# Altium schematic sheet IB_V2_MOSFET.SchDoc
size A3; SheetNumber: 3; SheetTotal: 5
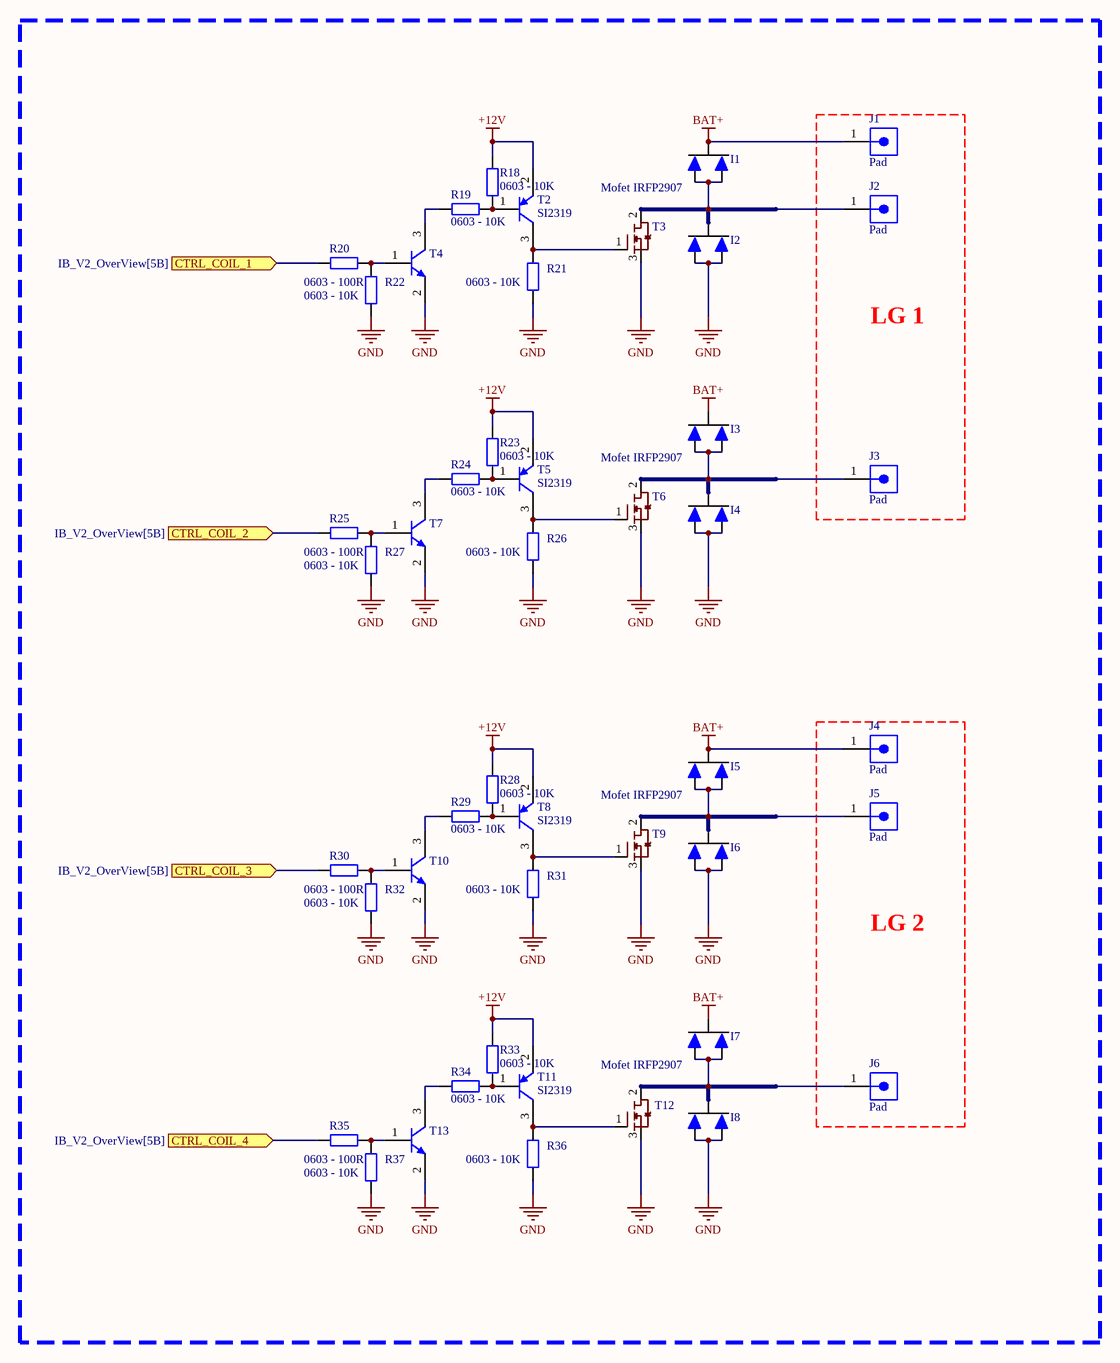
[diagram p0: IB_V2_MOSFET.SchDoc]

## Parts
I1  12CWQ10FN  [TO-252]  (value not drawn)
I2  12CWQ10FN  [TO-252]  (value not drawn)
I3  12CWQ10FN  [TO-252]  (value not drawn)
I4  12CWQ10FN  [TO-252]  (value not drawn)
I5  12CWQ10FN  [TO-252]  (value not drawn)
I6  12CWQ10FN  [TO-252]  (value not drawn)
I7  12CWQ10FN  [TO-252]  (value not drawn)
I8  12CWQ10FN  [TO-252]  (value not drawn)
J1  Pad  [pad_4.5x4.5_hole_2.5mm]
J2  Pad  [pad_4.5x4.5_hole_2.5mm]
J3  Pad  [pad_4.5x4.5_hole_2.5mm]
J4  Pad  [pad_4.5x4.5_hole_2.5mm]
J5  Pad  [pad_4.5x4.5_hole_2.5mm]
J6  Pad  [pad_4.5x4.5_hole_2.5mm]
R18  0603 - 10K  [tro smd 0603]
R19  0603 - 10K  [tro smd 0603]
R20  0603 - 100R  [tro smd 0603]
R21  0603 - 10K  [tro smd 0603]
R22  0603 - 10K  [tro smd 0603]
R23  0603 - 10K  [tro smd 0603]
R24  0603 - 10K  [tro smd 0603]
R25  0603 - 100R  [tro smd 0603]
R26  0603 - 10K  [tro smd 0603]
R27  0603 - 10K  [tro smd 0603]
R28  0603 - 10K  [tro smd 0603]
R29  0603 - 10K  [tro smd 0603]
R30  0603 - 100R  [tro smd 0603]
R31  0603 - 10K  [tro smd 0603]
R32  0603 - 10K  [tro smd 0603]
R33  0603 - 10K  [tro smd 0603]
R34  0603 - 10K  [tro smd 0603]
R35  0603 - 100R  [tro smd 0603]
R36  0603 - 10K  [tro smd 0603]
R37  0603 - 10K  [tro smd 0603]
T2  SI2319  [SOT - 23]
T3  Mofet IRFP2907  [TO 247 AC]
T4  MMBT2222A 1P Transistor NPN  [SOT - 23]  (value not drawn)
T5  SI2319  [SOT - 23]
T6  Mofet IRFP2907  [TO 247 AC]
T7  MMBT2222A 1P Transistor NPN  [SOT - 23]  (value not drawn)
T8  SI2319  [SOT - 23]
T9  Mofet IRFP2907  [TO 247 AC]
T10  MMBT2222A 1P Transistor NPN  [SOT - 23]  (value not drawn)
T11  SI2319  [SOT - 23]
T12  Mofet IRFP2907  [TO 247 AC]
T13  MMBT2222A 1P Transistor NPN  [SOT - 23]  (value not drawn)

## Blocks framed on the sheet
LG 1: J1-J3
LG 2: J4-J6

## Ports
CTRL_COIL_1 (in, see IB_V2_OverView[5B]), CTRL_COIL_2 (in, see IB_V2_OverView[5B]), CTRL_COIL_3 (in, see IB_V2_OverView[5B]), CTRL_COIL_4 (in, see IB_V2_OverView[5B])

## Nets
+12V: R18.1 R23.1 R28.1 R33.1 T2.2(E) T5.2(E) T8.2(E) T11.2(E)
BAT+: I1.2(Ktot) I3.2(Ktot) I5.2(Ktot) I7.2(Ktot) J1.1 J4.1
GND: I2.1(Anot) I2.3(Anot) I4.1(Anot) I4.3(Anot) I6.1(Anot) I6.3(Anot) I8.1(Anot) I8.3(Anot) R21.1 R22.1 R26.1 R27.1 R31.1 R32.1 R36.1 R37.1 T3.3(S) T4.2(E) T6.3(S) T7.2(E) T9.3(S) T10.2(E) T12.3(S) T13.2(E)
CTRL_COIL_1: R20.2 ; port CTRL_COIL_1
CTRL_COIL_2: R25.2 ; port CTRL_COIL_2
CTRL_COIL_3: R30.2 ; port CTRL_COIL_3
CTRL_COIL_4: R35.2 ; port CTRL_COIL_4
NetI1_1: I1.1(Anot) I1.3(Anot) I2.2(Ktot) J2.1 T3.2(D)
NetI3_1: I3.1(Anot) I3.3(Anot) I4.2(Ktot) J3.1 T6.2(D)
NetI5_1: I5.1(Anot) I5.3(Anot) I6.2(Ktot) J5.1 T9.2(D)
NetI7_1: I7.1(Anot) I7.3(Anot) I8.2(Ktot) J6.1 T12.2(D)
NetR18_2: R18.2 R19.1 T2.1(B)
NetR19_2: R19.2 T4.3(C)
NetR20_1: R20.1 R22.2 T4.1(B)
NetR21_2: R21.2 T2.3(C) T3.1(G)
NetR23_2: R23.2 R24.1 T5.1(B)
NetR24_2: R24.2 T7.3(C)
NetR25_1: R25.1 R27.2 T7.1(B)
NetR26_2: R26.2 T5.3(C) T6.1(G)
NetR28_2: R28.2 R29.1 T8.1(B)
NetR29_2: R29.2 T10.3(C)
NetR30_1: R30.1 R32.2 T10.1(B)
NetR31_2: R31.2 T8.3(C) T9.1(G)
NetR33_2: R33.2 R34.1 T11.1(B)
NetR34_2: R34.2 T13.3(C)
NetR35_1: R35.1 R37.2 T13.1(B)
NetR36_2: R36.2 T11.3(C) T12.1(G)

## Library data of the parts
I1-I8 = Diode - 12CWQ10FN: Diode Schottky 100V 12A, SMD DPAK
J1-J6 = Pad: Ports: 1; Positions/Loaded: Port1 - 4/2; PerformanceCategory: 3; PCB_Mounting: Thru-Hole; PCB_Thickness: 0.125"; DrillSize: Nominal, Rounded to nearest 0.05mm; PCB_Layout: Complies with Manufacturer's Recommendation.; Published: 25-Jun-2002; DatasheetDocument: 20-Nov-2001; PackageDocument: 20-Nov-2001; PackageReference: 42878-4410; Publisher: Altium Limited; ComponentLink1Description: Manufacturer Link; ComponentLink1URL: http://www.molex.com/; ComponentLink2Description: Datasheet; ComponentLink2URL: http://www.molex.com/cmc_upload/common_files/1212003_42878catalogpage.pdf
R18-R37 = Tro 0603 1% 680R: Dán; Don_Vi: Con; So_Chan: 2; Ten_Linh_Kien: Trở 0603 1% 680R; Ma_Hang: MH006336; Chung_Loai: Dán; Kieu_Chan: *
T2 T5 T8 T11 = Transistor - A1015: P-Channel 40-V(D-S) MOSEFET / SOT-23/3 LEAD
T3 T6 T9 T12 = IRFP2907
T4 T7 T10 T13 = Transistor - 2N2222: Transistor NPN 40V 0.6A 3 Chân SOT-23/3 LEAD